# EAGLE design MotorControllerV1 (EAGLE 9.3.1)
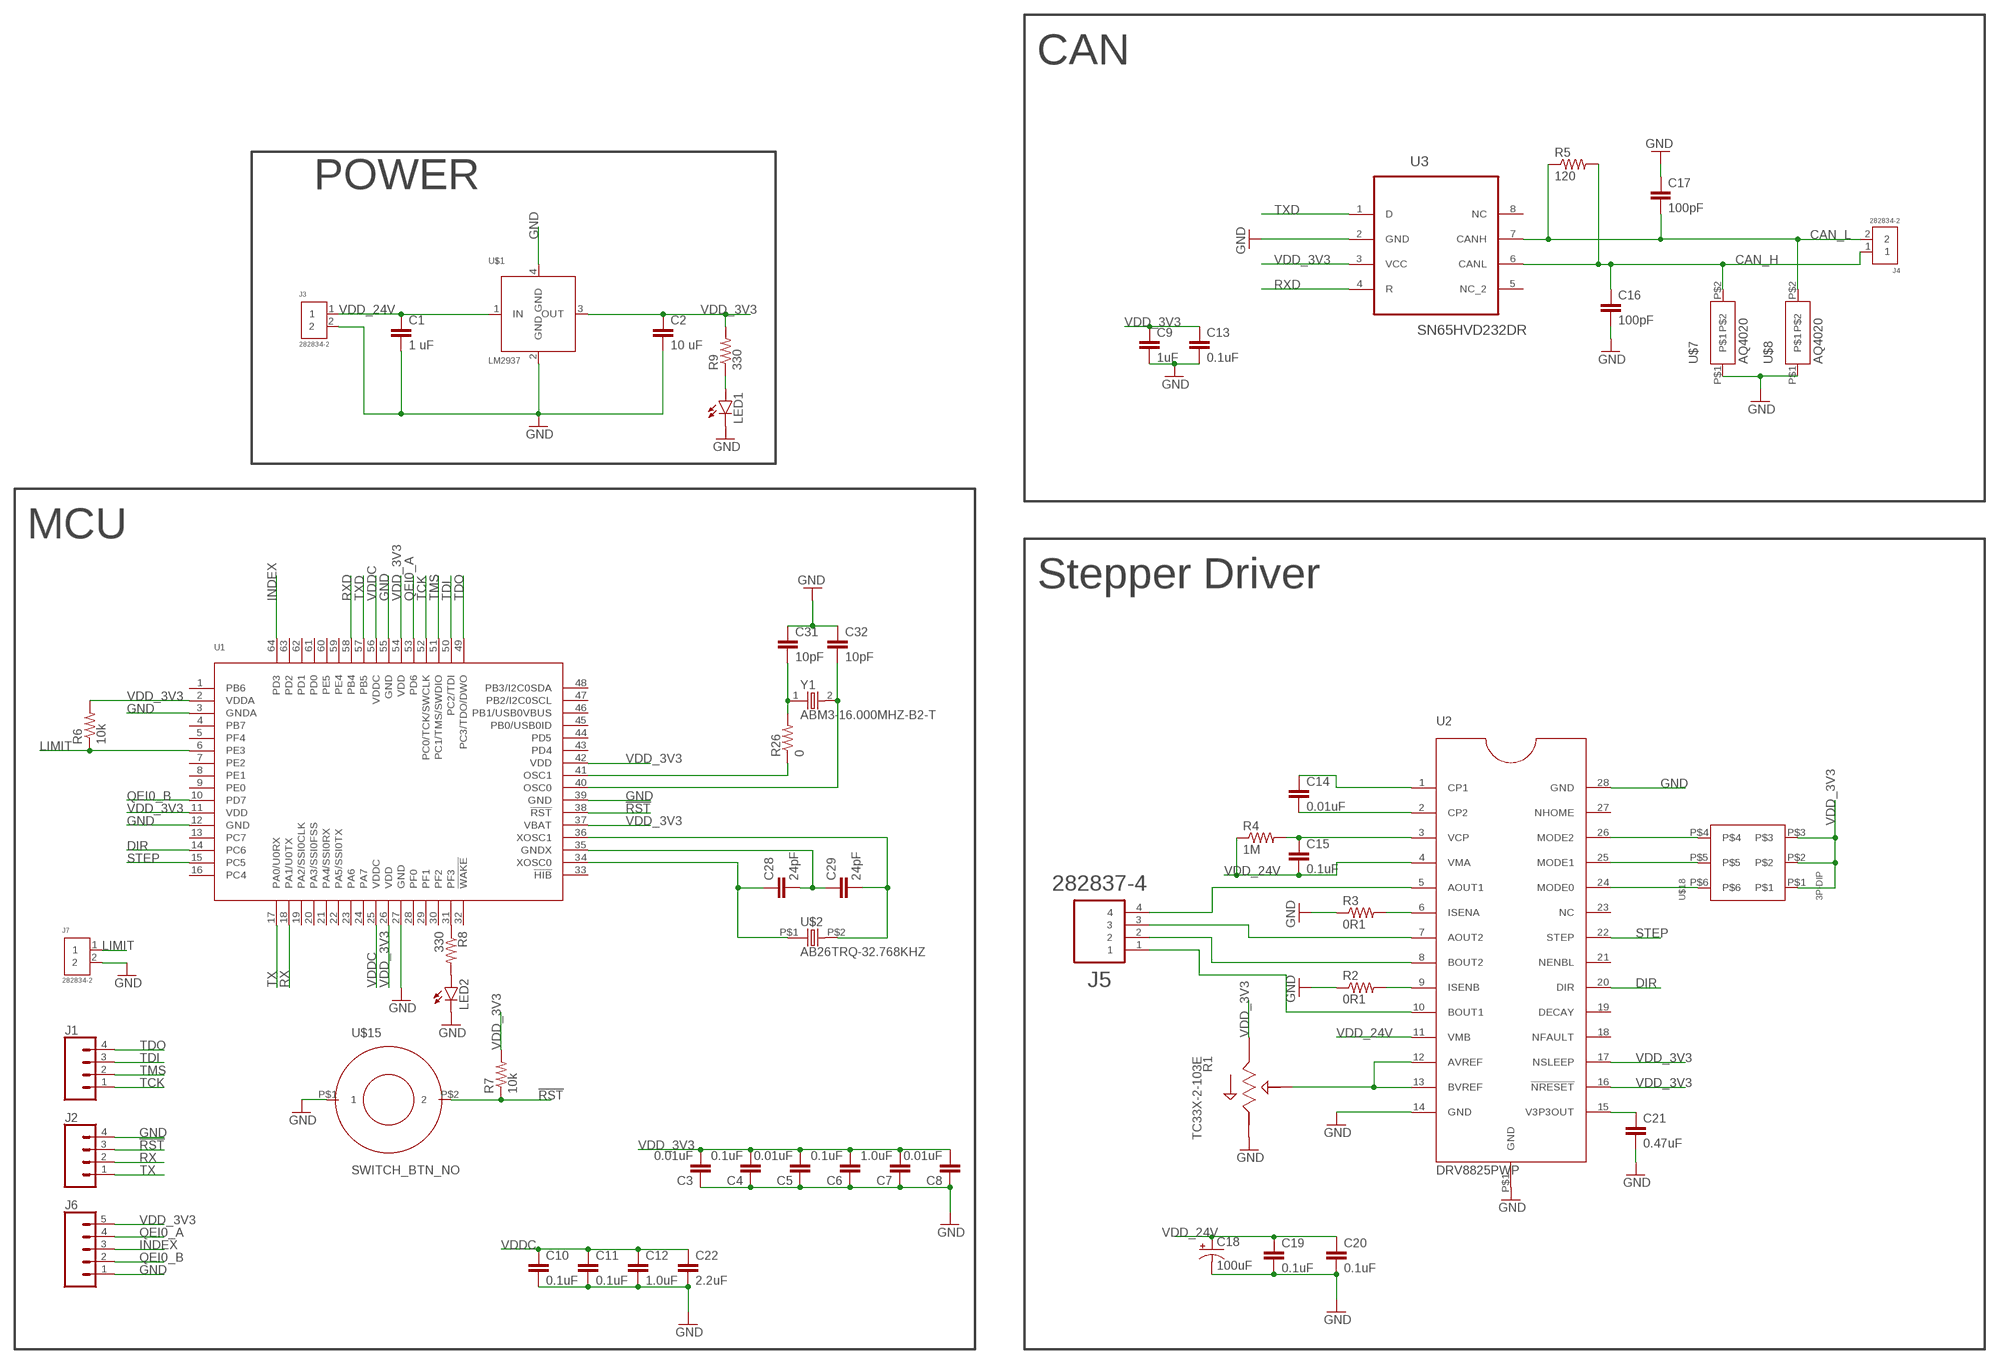
[diagram p0: schematic, sheet 1]

## Parts
C1  1 uF  CAP  [0805]
C2  10 uF  CAP  [0805]
C3  0.01uF  CAP  [0805]
C4  0.1uF  CAP  [0805]
C5  0.01uF  CAP  [0805]
C6  0.1uF  CAP  [0805]
C7  1.0uF  CAP  [0603]
C8  0.01uF  CAP  [0805]
C9  1uF  CAP  [0603]
C10  0.1uF  CAP  [0805]
C11  0.1uF  CAP  [0805]
C12  1.0uF  CAP  [0603]
C13  0.1uF  CAP  [0805]
C14  0.01uF  CAP  [0805]
C15  0.1uF  CAP  [0805]
C16  100pF  CAP  [0603]
C17  100pF  CAP  [0603]
C18  100uF  100UF-POL  [CPOL-RADIAL-3.5MM-8MM]
C19  0.1uF  CAP  [0603]
C20  0.1uF  CAP  [0603]
C21  0.47uF  CAP  [0603]
C22  2.2uF  CAP  [0805]
C28  24pF  CAP  [0805]
C29  24pF  CAP  [0805]
C31  10pF  CAP  [0805]
C32  10pF  CAP  [0805]
J1  CONN_04  [1X04]
J2  CONN_04  [1X04]
J3  282834-2  [CONN_282834-2]
J4  282834-2  [CONN_282834-2]
J5  282837-4  [TE_282837-4]
J6  CONN_05  [1X05]
J7  282834-2  [CONN_282834-2]
LED1  LED0603  [LED-0603]
LED2  LED0603  [LED-0603]
R1  TC33X-2-103E  [35WR]
R2  0R1  RES  [0805]
R3  0R1  RES  [0805]
R4  1M  RES  [0603]
R5  120  RES  [0603]
R6  10k  RES  [0603]
R7  10k  RES  [0603]
R8  330  RES  [0603]
R9  330  RES  [0603]
R26  0  RES  [0603]
U1  TM4C123GH6PMI  [QFP50P1200X1200X160-64N]
U2  DRV8825PWP  [SOP65P640X120-28N]
U3  SN65HVD232DR  [SOIC127P600X175-8N]
U$1  LM2937  [R-PDSO-G4]
U$2  AB26TRQ-32.768KHZ  [AB26TRQ]
U$7  AQ4020  [SOD323]
U$8  AQ4020  [SOD323]
U$15  SWITCH_BTN_NO  [BTN_2]
U$18  3P-DIP  [CFS-0302MB]
Y1  ABM3-16.000MHZ-B2-T  [XTAL500X320X130N]

## Nets
!RST: J2.3 R7.P$1 U1.38(!RST) U$15.P$2
CAN_H: C16.P$1 J4.1 R5.P$2 U3.6(CANL) U$7.P$2
CAN_L: C17.P$2 J4.2 R5.P$1 U3.7(CANH) U$8.P$2
DIR: U1.14(PC6) U2.20(DIR)
GND: C1.2 C2.2 C3.1 C4.1 C5.1 C6.1 C7.P$1 C8.1 C9.P$2 C10.2 C11.2 C12.P$2 C13.2 C16.P$2 C17.P$1 C18.2(-) C19.P$2 C20.P$2 C21.P$2 C22.2 C31.1 C32.1 J2.4 J3.2 J6.1 J7.2 LED1.C LED2.C R1.3 R2.1 R3.1 U1.3(GNDA) U1.12(GND) U1.27(GND) U1.39(GND) U1.55(GND) U2.14(GND) U2.28(GND) U2.P$1(GND) U3.2(GND) U$1.2(GND) U$1.4(GND) U$7.P$1 U$8.P$1 U$15.P$1
INDEX: J6.3 U1.64(PD3)
LIMIT: J7.1 R6.P$1 U1.6(PE3)
N$1: C29.2 U1.36(XOSC1) U$2.P$2
N$2: C28.1 U1.34(XOSC0) U$2.P$1
N$3: C28.2 C29.1 U1.35(GNDX)
N$4: R26.P$1 U1.41(OSC1)
N$5: LED1.A R9.P$1
N$6: C31.2 R26.P$2 Y1.1
N$7: C32.2 U1.40(OSC0) Y1.2
N$8: C14.2 U2.2(CP2)
N$9: C14.1 U2.1(CP1)
N$10: C15.1 R4.P$2 U2.3(VCP)
N$11: J5.4 U2.5(AOUT1)
N$12: R1.2 U2.12(AVREF) U2.13(BVREF)
N$13: J5.3 U2.7(AOUT2)
N$14: J5.2 U2.8(BOUT2)
N$15: J5.1 U2.10(BOUT1)
N$16: R3.2 U2.6(ISENA)
N$17: R2.2 U2.9(ISENB)
N$18: R8.P$1 U1.31(PF3)
N$19: LED2.A R8.P$2
N$20: C21.P$1 U2.15(V3P3OUT)
N$22: U2.26(MODE2) U$18.P$4
N$23: U2.25(MODE1) U$18.P$5
N$24: U2.24(MODE0) U$18.P$6
QEI0_A: J6.4 U1.53(PD6)
QEI0_B: J6.2 U1.10(PD7)
RX: J2.2 U1.18(PA1/U0TX)
RXD: U1.58(PB4) U3.4(R)
STEP: U1.15(PC5) U2.22(STEP)
TCK: J1.1 U1.52(PC0/TCK/SWCLK)
TDI: J1.3 U1.50(PC2/TDI)
TDO: J1.4 U1.49(PC3/TDO/DWO)
TMS: J1.2 U1.51(PC1/TMS/SWDIO)
TX: J2.1 U1.17(PA0/U0RX)
TXD: U1.57(PB5) U3.1(D)
VDD_3V3: C2.1 C3.2 C4.2 C5.2 C6.2 C7.P$2 C8.2 C9.P$1 C13.1 J6.5 R1.1 R6.P$2 R7.P$2 R9.P$2 U1.2(VDDA) U1.11(VDD) U1.26(VDD) U1.37(VBAT) U1.42(VDD) U1.54(VDD) U2.16(!NRESET) U2.17(NSLEEP) U3.3(VCC) U$1.3(OUT) U$18.P$1 U$18.P$2 U$18.P$3
VDD_24V: C1.1 C15.2 C18.1(+) C19.P$1 C20.P$1 J3.1 R4.P$1 U2.4(VMA) U2.11(VMB) U$1.1(IN)
VDDC: C10.1 C11.1 C12.P$1 C22.1 U1.25(VDDC) U1.56(VDDC)
Unconnected: U1.1(PB6) U1.4(PB7) U1.5(PF4) U1.7(PE2) U1.8(PE1) U1.9(PE0) U1.13(PC7) U1.16(PC4) U1.19(PA2/SSI0CLK) U1.20(PA3/SSI0FSS) U1.21(PA4/SSI0RX) U1.22(PA5/SSI0TX) U1.23(PA6) U1.24(PA7) U1.28(PF0) U1.29(PF1) U1.30(PF2) U1.32(!WAKE) U1.33(!HIB) U1.43(PD4) U1.44(PD5) U1.45(PB0/USB0ID) U1.46(PB1/USB0VBUS) U1.47(PB2/I2C0SCL) U1.48(PB3/I2C0SDA) U1.59(PE4) U1.60(PE5) U1.61(PD0) U1.62(PD1) U1.63(PD2) U2.18(NFAULT) U2.19(DECAY) U2.21(NENBL) U2.23(NC) U2.27(NHOME) U3.5(NC_2) U3.8(NC)

## Notes on the sheet
- CAN
- POWER
- MCU
- Stepper Driver

## Library data of the parts
C1-C6 C8 C10 C11 C13-C15 C22 C28 C29 C31 C32 = Ilya_Teach:CAP
C7 C9 C12 C16 C17 C19-C21 = MicahLBR:CAP
C18 = MicahLBR:100UF-POL
J1 J2 = SparkFun-Connectors:CONN_04: Multi connection point. Often used as Generic Header-pin footprint for 0.1 inch spaced/style header connections On any of the 0.1 inch spaced packages, you can populate with these: Break Away Headers - Straight <https://www.sparkfun.com/products/116> (PRT-00116) Break Away Male Headers - Right Angle <https://www.sparkfun.com/products/553> (PRT-00553) Female Headers <https://www.sparkfun.com/products/115> (PRT-00115) Break Away Headers - Machine Pin <https://www.sparkfun.com/products/117> (PRT-00117) Break Away Female Headers - Swiss Machine Pin <https://www.sparkfun.com/products/743> (PRT-00743) For SCREWTERMINALS and SPRING TERMINALS visit here: Screw Terimnals on SparkFun.com <https://www.sparkfun.com/search/results?term=Screw+Terminals> (5mm/3.5mm/2.54mm spacing) This device is also useful as a general connection point to wire up your design to another part of your project. Our various solder wires solder well into these plated through hole pads. Hook-Up Wire - Assortment (Stranded, 22 AWG) <https://www.sparkfun.com/products/11375> (PRT-11375) Hook-Up Wire - Assortment (Solid Core, 22 AWG) <https://www.sparkfun.com/products/11367> (PRT-11367) View the entire wire category on our website here <https://www.sparkfun.com/categories/141> Special notes: Molex polarized connector foot print use with SKU : PRT-08231 with associated crimp pins and housings. 1MM SMD Version SKU: PRT-10208; PROD_ID: CONN-09696
J3 J4 J7 = 282834-2:282834-2: Terminal block; 2.54mm; angled 90°; 0.03÷1mm2; ways: 2; 10A; H: 10mm; CENTERLINE_PITCH: 2.54 mm[.1 in]; COMMENT: 282834-2; DESCRIPTION: TERMI-BLOK PCB MOUNT, 90 2P.; DIGI-KEY_PART_NUMBER: A98333-ND; DIGI-KEY_PURCHASE_URL: https://www.digikey.com/product-detail/en/te-connectivity-amp-connectors/282834-2/A98333-ND/1150135?utm_source=snapeda&utm_medium=aggregator&utm_campaign=symbol; EU_ROHS_COMPLIANCE: Compliant with Exemptions; MF: TE Connectivity; MP: 282834-2; NUMBER_OF_POSITIONS: 2; PACKAGE: None; TE_PURCHASE_URL: https://www.te.com/usa-en/product-282834-2.html?te_bu=Cor&te_type=disp&te_campaign=seda_glo_cor-seda-global-disp-prtnr-fy19-seda-model-bom-cta_sma-317_1&elqCampaignId=32493
J5 = 282837-4:282837-4: TERM BLOCK 5.08MM 4POS SIDE ENTY; COMMENT: 282837-4; DESCRIPTION: TERMI-BLOK PCB MOUNT 4P; DIGI-KEY_PART_NUMBER: A124423-ND; DIGI-KEY_PURCHASE_URL: https://www.digikey.com/product-detail/en/te-connectivity-amp-connectors/282837-4/A124423-ND/2187975?utm_source=snapeda&utm_medium=aggregator&utm_campaign=symbol; EU_ROHS_COMPLIANCE: Compliant with Exemptions; MF: TE Connectivity; MP: 282837-4; PACKAGE: None; TE_PURCHASE_URL: https://www.te.com/usa-en/product-282837-4.html?te_bu=Cor&te_type=disp&te_campaign=seda_glo_cor-seda-global-disp-prtnr-fy19-seda-model-bom-cta_sma-317_1&elqCampaignId=32493
J6 = SparkFun-Connectors:CONN_05: Multi connection point. Often used as Generic Header-pin footprint for 0.1 inch spaced/style header connections On any of the 0.1 inch spaced packages, you can populate with these: Break Away Headers - Straight <https://www.sparkfun.com/products/116> (PRT-00116) Break Away Male Headers - Right Angle <https://www.sparkfun.com/products/553> (PRT-00553) Female Headers <https://www.sparkfun.com/products/115> (PRT-00115) Break Away Headers - Machine Pin <https://www.sparkfun.com/products/117> (PRT-00117) Break Away Female Headers - Swiss Machine Pin <https://www.sparkfun.com/products/743> (PRT-00743) For SCREWTERMINALS and SPRING TERMINALS visit here: Screw Terimnals on SparkFun.com <https://www.sparkfun.com/search/results?term=Screw+Terminals> (5mm/3.5mm/2.54mm spacing) This device is also useful as a general connection point to wire up your design to another part of your project. Our various solder wires solder well into these plated through hole pads. Hook-Up Wire - Assortment (Stranded, 22 AWG) <https://www.sparkfun.com/products/11375> (PRT-11375) Hook-Up Wire - Assortment (Solid Core, 22 AWG) <https://www.sparkfun.com/products/11367> (PRT-11367) View the entire wire category on our website here <https://www.sparkfun.com/categories/141> Special notes: Molex polarized connector foot print use with SKU : PRT-08231 with associated crimp pins and housings. 1MM SMD Version SKU: PRT-10208
LED1 LED2 = Ilya_Teach:LED: LEDs Standard schematic elements and footprints for 5mm, 3mm, 1206, and 0603 sized LEDs. 5mm - Spark Fun Electronics SKU : COM-00529 (and others)
R1 = TC33X-2-103E:TC33X-2-103E: http://octopart.com/tc33x-2-103e-bourns-68150; DESCRIPTION: Res Trimmer 10K Ohm 25% 0.1W_1/10W_ 1_Elec_/1_Mech_Turn _3 X 3.8mm_ Foot Print SMD Embossed T/R; DIGI-KEY_PART_NUMBER: TC33X-103ECT-ND; DIGI-KEY_PURCHASE_URL: https://www.digikey.com/product-detail/en/bourns-inc/TC33X-2-103E/TC33X-103ECT-ND/612911?utm_source=snapeda&utm_medium=aggregator&utm_campaign=symbol; MF: Bourns; MP: TC33X-2-103E; PACKAGE: FakePackage u
R2 R3 = Ilya_Teach:RES
R4-R9 R26 = MicahLBR:RES
U1 = TM4C123GH6PMI:TM4C123GH6PMI: MCU 32-Bit Tiva C ARM Cortex M4F RISC 256KB Flash 1.2V/3.3V 64-Pin LQFP Tray/Tube; AVAILABILITY: Unavailable; DESCRIPTION: MCU 32-Bit Tiva C ARM Cortex M4F RISC 256KB Flash 1.2V/3.3V 64-Pin LQFP Tray/Tube; MF: Texas Instruments; MP: TM4C123GH6PMI; PACKAGE: LQFP-64 Texas Instruments; PRICE: None
U2 = DRV8825PWP:DRV8825PWP: DRV8825 Stepper Motor Controller IC; AVAILABILITY: Unavailable; DESCRIPTION: 2.5A Bipolar Stepper Motor Driver with On-Chip 1/32 Microstepping Indexer _Step/Dir Ctrl_ 28-HTSSOP -40 to 85; MF: Texas Instruments; MP: DRV8825PWP; PACKAGE: HTSSOP-28 Texas Instruments; PRICE: None
U3 = SN65HVD232DR:SN65HVD232DR: 3.3-V CAN TRANSCEIVERS; AVAILABILITY: Unavailable; DESCRIPTION: CAN 1Mbps 3.3V Industrial 8-Pin SOIC T/R; MF: Texas Instruments; MP: SN65HVD232DR; PACKAGE: SOIC-8 Texas Instruments; PRICE: None
U$1 = MicahLBR:LM2937
U$2 = MicahLBR:AB26TRQ-32.768KHZ
U$7 U$8 = MicahLBR:AQ4020
U$15 = Ilya_Teach:SWITCH_BTN_NO
U$18 = MicahLBR:3P-DIP
Y1 = ABM3-16.000MHZ-B2-T:ABM3-16.000MHZ-B2-T: Crystals 12MHz 18pF 30ppm -40C +85C; AVAILABILITY: Unavailable; DESCRIPTION: Crystal 16MHz Ø·Â¢Ø¢Â±20ppm _Tol_ Ø·Â¢Ø¢Â±50ppm _Stability_ 18pF FUND 50Ohm 2-Pin CSMD T/R; MF: Abracon; MP: ABM3-16.000MHZ-B2-T; PACKAGE: SMD-2 Abracon; PRICE: None

## Board
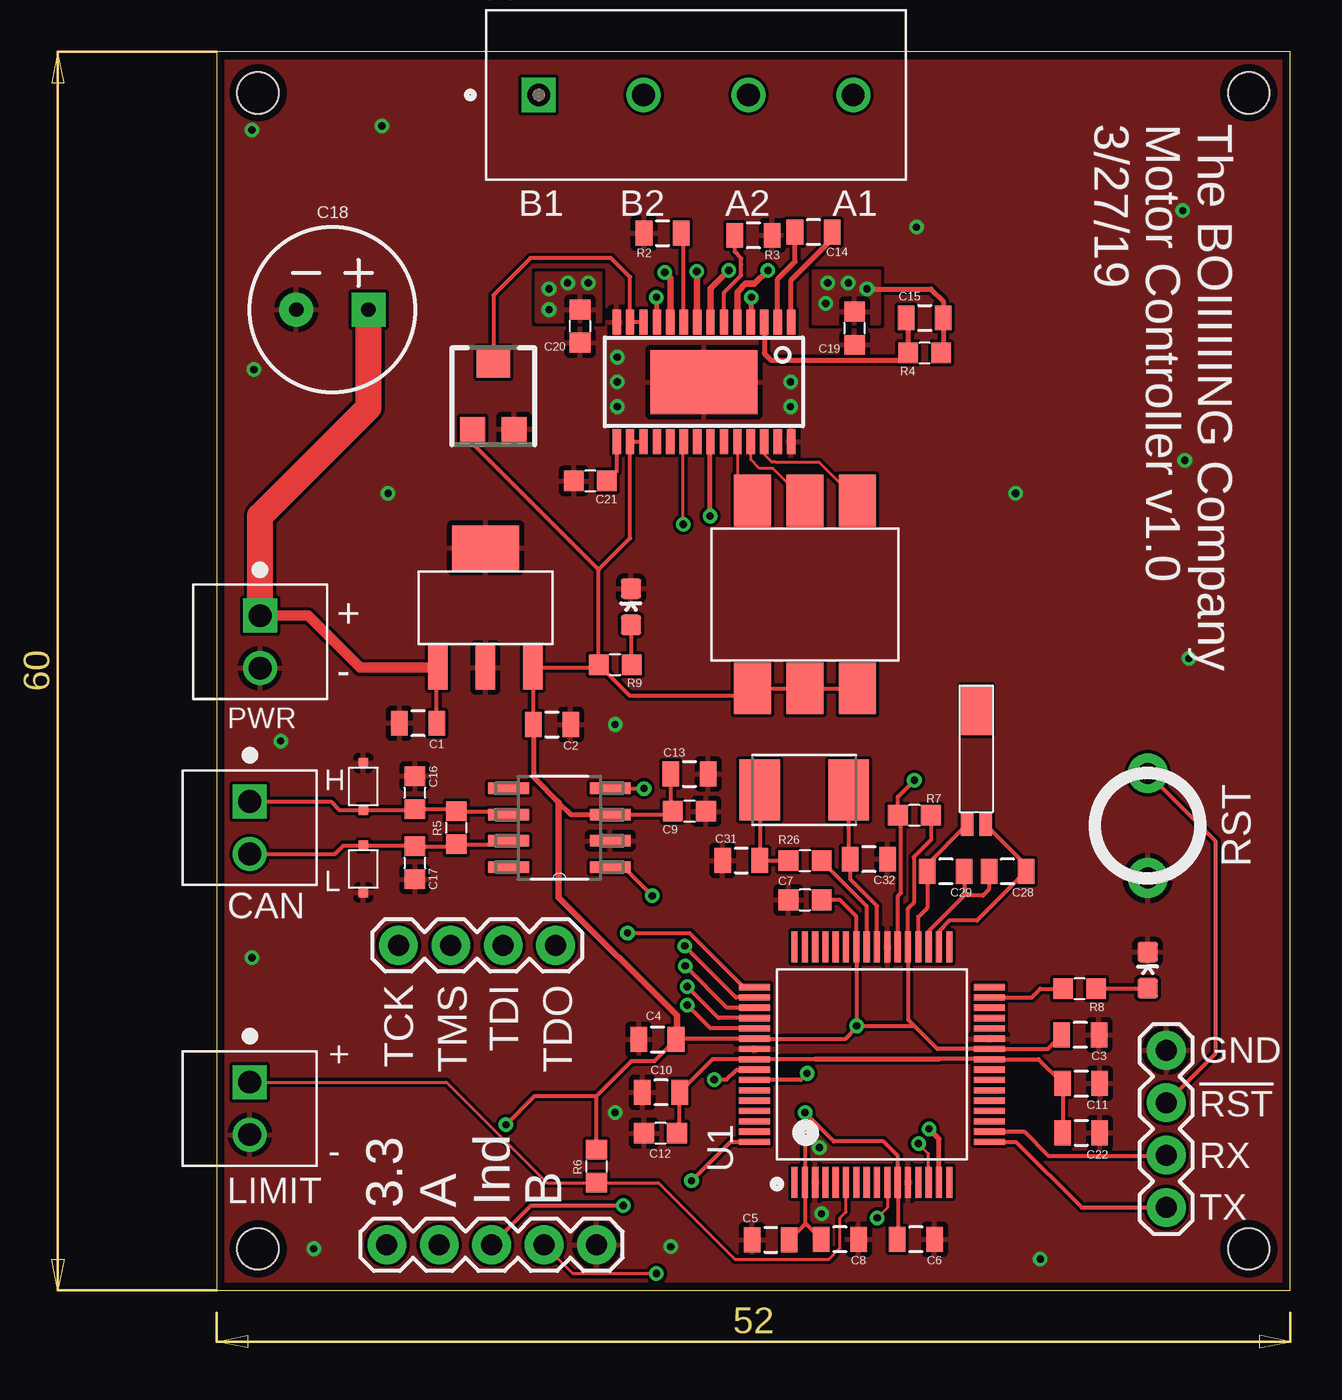
[diagram p1: board, top side]
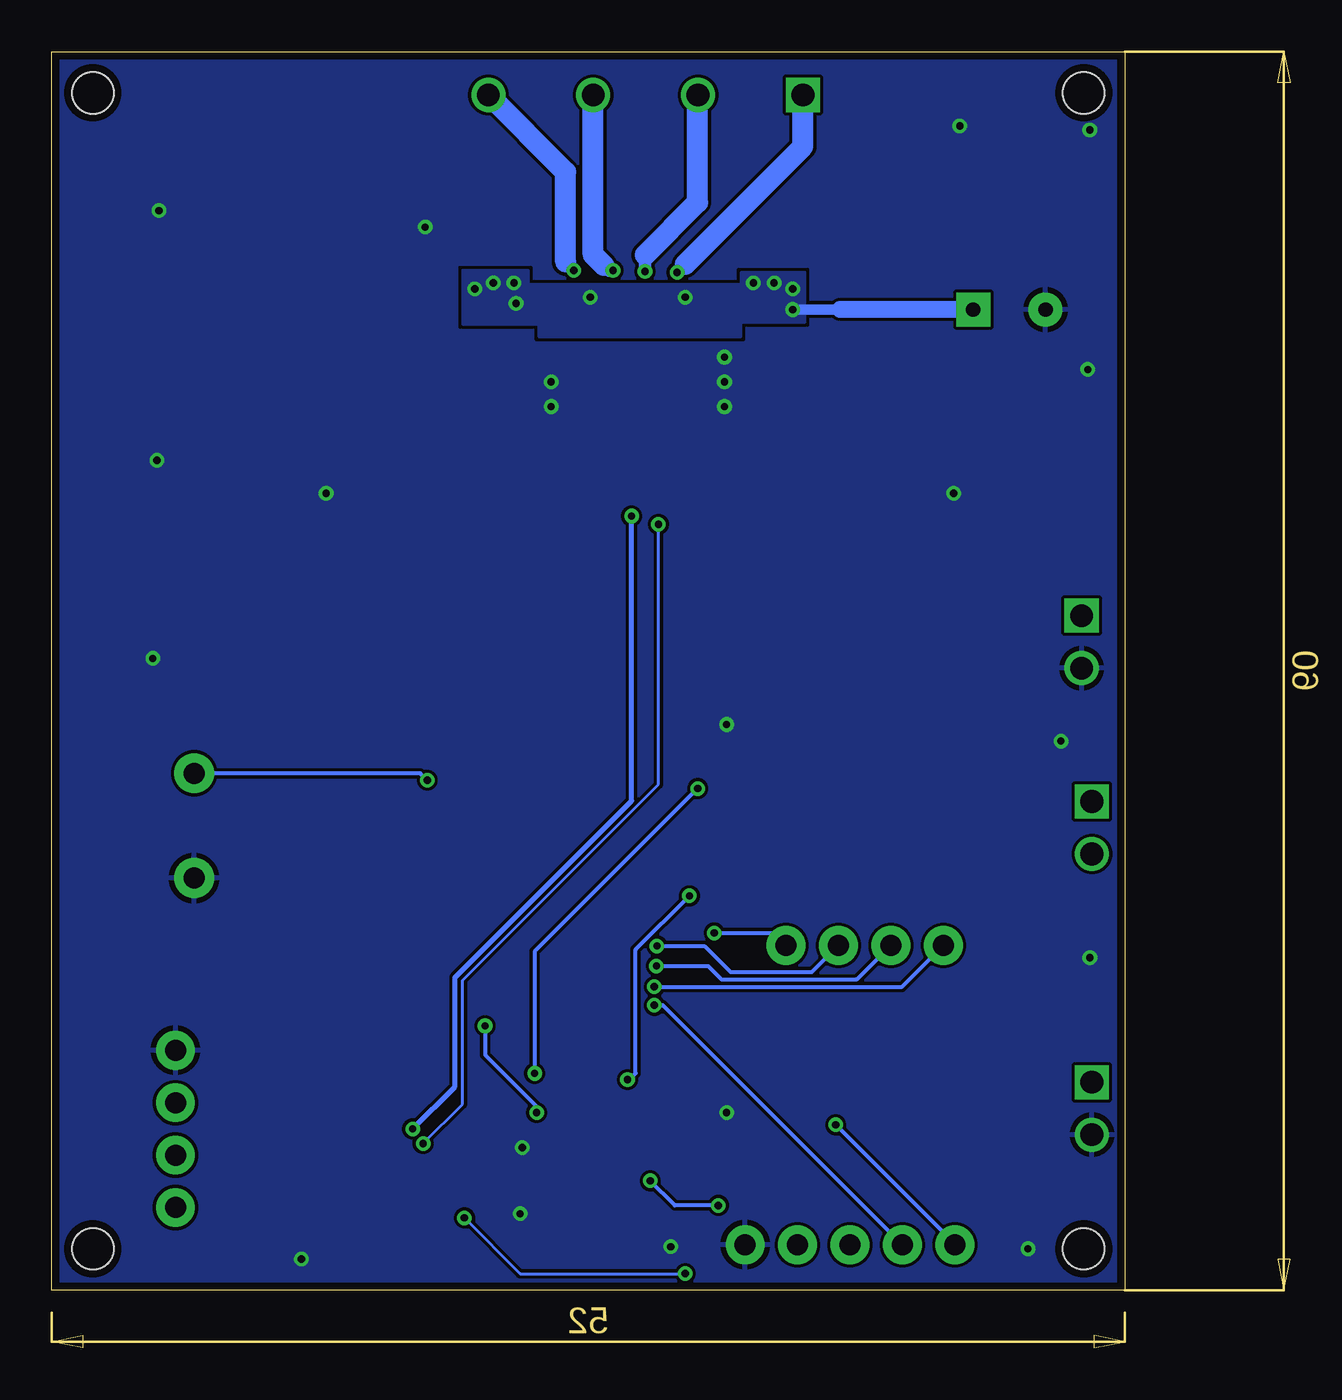
[diagram p2: board, bottom side, seen from below]

Size 52 x 60 mm. Coordinates in mm from the lower left corner, seen from the top.
Outline: 0,0 52,0 52,60 0,60 0,0
Copper layers (1*16): Top 0.0356mm / dielectric 1.5011mm / Bottom 0.0356mm
Design rules "LaenPCBOrder": minimum track width 6mil, minimum drill 13mil, track to track 6mil, track to pad 6mil, pad to pad 6mil, via to via 6mil, smd to smd 6mil, copper to edge 15mil, drill to drill 6mil, minimum pad ring 7mil, minimum via ring 7mil, stop-mask expansion 3mil, vias tented up to drill 0mil, thermal gap 10mil
Holes 2 mm at 2,2 50,2 2,58 50,58

### Footprints (pad centres in the part's own frame; a part is rotated, then mirrored left to right if it is on the bottom)
0805 = smd 0.8 x 1.2: 1 -0.9,0; 2 0.9,0
0603 = smd 0.95 x 1: P$1 -0.8,0; P$2 0.8,0
CPOL-RADIAL-3.5MM-8MM = drill 0.7 pad 1.651 square: 1 1.75,0 | drill 0.7 pad 1.651: 2 -1.75,0
1X04 = drill 1.016 pad 1.88: 1 0,0; 2 2.54,0; 3 5.08,0; 4 7.62,0
CONN_282834-2 = drill 1.1 square: 1 -1.27,0 | drill 1.1: 2 1.27,0
TE_282837-4 = drill 1.1 square: 1 0,0 | drill 1.1: 2 5.08,0; 3 10.16,0; 4 15.24,0
1X05 = drill 1.016 pad 1.88: 1 0,0; 2 2.54,0; 3 5.08,0; 4 7.62,0; 5 10.16,0
LED-0603 = smd 1 x 1: A 0,-0.877; C 0,0.877
35WR = smd 1.2 x 1.2: 1 -1,-1.6; 3 1,-1.6 | smd 1.6 x 1.5: 2 0,1.65
QFP50P1200X1200X160-64N = smd 1.5 x 0.3: 1 -5.7,3.75; 2 -5.7,3.25; 3 -5.7,2.75; 4 -5.7,2.25; 5 -5.7,1.75; 6 -5.7,1.25; 7 -5.7,0.75; 8 -5.7,0.25; 9 -5.7,-0.25; 10 -5.7,-0.75; 11 -5.7,-1.25; 12 -5.7,-1.75; 13 -5.7,-2.25; 14 -5.7,-2.75; 15 -5.7,-3.25; 16 -5.7,-3.75; 33 5.7,-3.75; 34 5.7,-3.25; 35 5.7,-2.75; 36 5.7,-2.25; 37 5.7,-1.75; 38 5.7,-1.25; 39 5.7,-0.75; 40 5.7,-0.25; 41 5.7,0.25; 42 5.7,0.75; 43 5.7,1.25; 44 5.7,1.75; 45 5.7,2.25; 46 5.7,2.75; 47 5.7,3.25; 48 5.7,3.75 | smd 0.3 x 1.5: 17 -3.75,-5.7; 18 -3.25,-5.7; 19 -2.75,-5.7; 20 -2.25,-5.7; 21 -1.75,-5.7; 22 -1.25,-5.7; 23 -0.75,-5.7; 24 -0.25,-5.7; 25 0.25,-5.7; 26 0.75,-5.7; 27 1.25,-5.7; 28 1.75,-5.7; 29 2.25,-5.7; 30 2.75,-5.7; 31 3.25,-5.7; 32 3.75,-5.7; 49 3.75,5.7; 50 3.25,5.7; 51 2.75,5.7; 52 2.25,5.7; 53 1.75,5.7; 54 1.25,5.7; 55 0.75,5.7; 56 0.25,5.7; 57 -0.25,5.7; 58 -0.75,5.7; 59 -1.25,5.7; 60 -1.75,5.7; 61 -2.25,5.7; 62 -2.75,5.7; 63 -3.25,5.7; 64 -3.75,5.7
SOP65P640X120-28N = smd 1.2 x 0.4: 1 -2.9,4.225; 2 -2.9,3.575; 3 -2.9,2.925; 4 -2.9,2.275; 5 -2.9,1.625; 6 -2.9,0.975; 7 -2.9,0.325; 8 -2.9,-0.325; 9 -2.9,-0.975; 10 -2.9,-1.625; 11 -2.9,-2.275; 12 -2.9,-2.925; 13 -2.9,-3.575; 14 -2.9,-4.225; 15 2.9,-4.225; 16 2.9,-3.575; 17 2.9,-2.925; 18 2.9,-2.275; 19 2.9,-1.625; 20 2.9,-0.975; 21 2.9,-0.325; 22 2.9,0.325; 23 2.9,0.975; 24 2.9,1.625; 25 2.9,2.275; 26 2.9,2.925; 27 2.9,3.575; 28 2.9,4.225 | smd 3.1 x 5.18: P$1 0,0
SOIC127P600X175-8N = smd 1.981 x 0.559: 1 -2.464,1.905; 2 -2.464,0.635; 3 -2.464,-0.635; 4 -2.464,-1.905; 5 2.464,-1.905; 6 2.464,-0.635; 7 2.464,0.635; 8 2.464,1.905
R-PDSO-G4 = smd 0.95 x 2.15: 1 -2.3,-2.9; 2 0,-2.9; 3 2.3,-2.9 | smd 3.25 x 2.15: 4 0,2.9
AB26TRQ = smd 1.1 x 0.6: P$1 2.45,0.45; P$2 2.45,-0.45 | smd 2.4 x 1.5: P$3 -3.1,0
SOD323 = smd 0.49 x 0.45: P$1 1.14,0; P$2 -1.14,0
BTN_2 = drill 1.016 pad 1.93: P$1 -2.54,0; P$2 2.54,0
CFS-0302MB = smd 1.8 x 2.5: P$1 -2.54,-4.55; P$2 0,-4.55; P$3 2.54,-4.55; P$4 2.54,4.55; P$5 0,4.55; P$6 -2.54,4.55
XTAL500X320X130N = smd 1.95 x 2.95: 1 -2.15,0; 2 2.15,0

### Placement (x,y rotation side)
C1  9.76,27.47 180 top
C2  16.24,27.41 0 top
C3  41.84,12.36 180 top
C4  21.35,12.14 0 top
C5  26.84,2.44 0 top
C6  33.87,2.46 180 top
C7  28.5,18.9 0 top
C8  30.19,2.46 180 top
C9  22.9,23.2 0 top
C10  21.52,9.58 180 top
C11  41.88,10.01 0 top
C12  21.5,7.6 180 top
C13  22.9,25 0 top
C14  28.91,51.25 180 top
C15  34.3,47.1 0 top
C16  9.6,24.1 90 top
C17  9.6,20.7 90 top
C18  5.6,47.5 0 top
C19  30.9,46.6 270 top
C20  17.6,46.7 270 top
C21  18.1,39.2 180 top
C22  41.88,7.62 0 top
C28  38.31,20.28 180 top
C29  35.32,20.28 180 top
C31  25.41,20.82 0 top
C32  31.6,20.88 180 top
J1  8.8,16.7 0 top
J2  46,4 90 top
J3  2.1,31.4 270 top
J4  1.6,22.4 270 top
J5  15.6,57.9 0 top
J6  18.4,2.2 180 top
J7  1.6,8.8 270 top
LED1  20.07,33.1 0 top
LED2  45.1,15.5 0 top
R1  13.4,43.3 0 top
R2  21.6,51.2 0 top
R3  26,51.1 180 top
R4  34.3,45.4 180 top
R5  11.6,22.4 90 top
R6  18.4,6 90 top
R7  33.8,23 0 top
R8  41.8,14.6 0 top
R9  19.3,30.3 180 top
R26  28.5,20.8 180 top
U1  31.74,10.93 90 top
U2  23.6,44 270 top
U3  16.6,22.4 180 top
U$1  13.02,33.06 0 top
U$2  36.8,25 270 top
U$7  7.1,24.4 90 top
U$8  7.1,20.4 270 top
U$15  45.1,22.5 90 top
U$18  28.5,33.7 0 top
Y1  28.46,24.23 0 top

### Tracks (layer width: path | path; a pad name or v marks a point on that pad's centre or on a via)
!RST  (via drill 0.35)
  Top 0.2: U1.38 32.99,19.09 33.15,19.25 33.15,22.85 R7.P$1 33,23.9 v33.8,24.7 | J2.3 48.4,11.48 48.4,21.74 U$15.P$2
  Bottom 0.2: v33.8,24.7 34.14,25.04 U$15.P$2
CAN_H
  Top 0.2: J4.1 5.53,23.67 5.94,23.26 U$7.P$2 9.56,23.26 C16.P$1 11.5,23.3 R5.P$2 13.97,23.2 U3.6
CAN_L
  Top 0.2: J4.2 5.73,21.13 6.14,21.54 U$8.P$2 9.56,21.54 C17.P$2 11.5,21.5 R5.P$1 13.97,21.6 U3.7
DIR  (via drill 0.35)
  Top 0.152: U1.14 34.49,6.61 v34,7.1 | v22.6,37.1 22.6,41.08 U2.20
  Bottom 0.152: v34,7.1 32.1,9 32.1,15 22.6,24.5 v22.6,37.1
GND  (via drill 0.35)
  other vias: 29.2,6.9 22,2.1 29.3,3.7 19.3,8.6 1.8,44.6 1.7,56.2 8,56.4 19.4,45.2 19.4,44 19.4,42.8 27.8,44 27.8,42.8 1.7,16.1 4.7,2 3.1,26.6 39.9,1.5 19.3,27.4 8.3,38.6 33.9,51.5 46.8,52.3 46.9,40.2 47.1,30.6 38.7,38.6
  pour Top (rank 2): 0,60 0,0 60,0 60,60
  pour Bottom (rank 2): 0,60 0,0 60,0 60,60
INDEX  (via drill 0.35)
  Top 0.2: J6.3 15.22,4.1 v19.7,4.1 | v23,5.3 24.88,7.18 U1.64
  Bottom 0.2: v19.7,4.1 21.8,4.1 v23,5.3
LIMIT
  Top 0.152: J7.1 11.13,10.07 16,5.2 R6.P$1 21.4,5.2 25.1,1.5 29.65,1.5 30.2,2.05 30.2,3.5 30.49,3.79 U1.6
N$1
  Top 0.2: U1.36 33.99,18.09 34.42,18.52 C29.2 34.42,20.62 U$2.P$2
N$2
  Top 0.2: U$2.P$1 39.21,20.59 C28.1 36.83,17.9 35.5,17.9 34.99,17.39 U1.34
N$3
  Top 0.2: U1.35 34.5,17.4 36.22,19.12 | C29.1 36.22,19.12 | C28.2 37.4,19.4 37.12,19.12 36.22,19.12
N$4
  Top 0.2: U1.41 31.49,18.6 29.3,20.79 R26.P$1
N$5
  Top 0.2: R9.P$1 20.1,32.19 LED1.A
N$6
  Top 0.2: R26.P$2 26.33,20.8 C31.2 Y1.1
N$7
  Top 0.2: Y1.2 30.61,20.97 C32.2 30.7,19.9 31.99,18.61 U1.40
N$8
  Top 0.254: U2.2 27.18,48.98 28.01,49.81 C14.2
N$9
  Top 0.254: U2.1 27.82,48.92 29.81,50.91 C14.1
N$10
  Top 0.254: U2.3 26.52,45.38 26.85,45.05 33.15,45.05 R4.P$2 33.5,47 C15.1
N$11  (via drill 0.35)
  Top 0.305: v26.7,49.4 26.06,48.76 25.63,48.76 25.23,48.35 25.23,48.2 U2.5
  Bottom 0.61: v26.7,49.4 27.1,49.8
  Bottom 1.016: J5.4 27.1,54.16 27.1,49.8
N$12
  Top 0.2: U2.12 U2.13 20.02,49.08 19.1,50 15.2,50 13.4,48.2 R1.2
N$13  (via drill 0.35)
  Top 0.305: U2.7 23.93,48.52 v24.8,49.4
  Bottom 0.61: v24.8,49.4 25,49.4 25.25,49.65
  Bottom 1.016: 25.25,49.65 25.76,50.16 J5.3
N$14  (via drill 0.35)
  Top 0.305: U2.8 23.27,49.33 v23.25,49.35
  Bottom 0.61: v23.25,49.35 23.25,50.15
  Bottom 1.016: 23.25,50.15 20.7,52.7 20.7,57.88 J5.2
N$15  (via drill 0.35)
  Top 0.305: U2.10 21.98,49.02 v21.7,49.3
  Bottom 0.61: v21.7,49.3 21.3,49.7
  Bottom 1.016: J5.1 15.6,55.4 21.3,49.7
N$16
  Top 0.2: 25.41,49.69 25.41,49.99 25.1,50.3 R3.2
  Top 0.203: U2.6 24.57,48.32 25.41,49.15 25.41,49.69
N$17
  Top 0.203: U2.9 22.62,51.08 R2.2
N$18
  Top 0.2: U1.31 39.48,14.18 39.9,14.6 R8.P$1
N$19
  Top 0.2: R8.P$2 42.62,14.62 LED2.A
N$20
  Top 0.2: U2.15 19.38,39.67 C21.P$1
N$22
  Top 0.152: U$18.P$4 29.19,40.1 27.08,40.1 26.9,40.1 26.52,40.48 U2.26
N$23
  Top 0.152: U$18.P$5 26.95,39.8 26.3,39.8 25.88,40.23 25.88,40.9
  Top 0.2: 25.88,40.9 U2.25
N$24
  Top 0.152: U2.24 25.23,38.98 U$18.P$6
QEI0_A  (via drill 0.35)
  Top 0.2: U1.53 23.92,12.68 v22.8,13.8
  Bottom 0.2: v22.8,13.8 22.38,13.8 J6.4
QEI0_B  (via drill 0.35)
  Top 0.152: U1.10 32.49,3.99 v32,3.5 | v21.3,0.8 17.26,0.8 J6.2
  Bottom 0.152: v32,3.5 29.3,0.8 v21.3,0.8
RX
  Top 0.2: U1.18 39.12,7.68 40.3,6.5 45.96,6.5 J2.2
RXD  (via drill 0.35)
  Top 0.2: U3.4 v20.7,24.3 | v28.6,10.5 28.28,10.18 U1.58
  Bottom 0.2: v20.7,24.3 28.6,16.4 v28.6,10.5
STEP  (via drill 0.35)
  Top 0.254: U1.15 34.99,7.32 v34.51,7.81 | v23.9,37.5 23.9,41.08 U2.22
  Bottom 0.254: v34.51,7.81 32.46,9.86 32.46,15.15 23.9,23.7 v23.9,37.5
TCK  (via drill 0.35)
  Top 0.2: U1.52 24.32,13.18 v22.8,14.7
  Bottom 0.2: v22.8,14.7 10.8,14.7 J1.1
TDI  (via drill 0.35)
  Top 0.2: U1.50 25.16,14.18 v22.67,16.67
  Bottom 0.2: v22.67,16.67 20.37,16.67 19.11,15.4 15.18,15.4 J1.3
TDO  (via drill 0.35)
  Top 0.2: U1.49 25.52,14.68 22.92,17.28 19.92,17.28 v19.9,17.3
  Bottom 0.2: v19.9,17.3 17.02,17.3 J1.4
TMS  (via drill 0.35)
  Top 0.2: U1.51 24.72,13.68 v22.7,15.7
  Bottom 0.2: v22.7,15.7 20.2,15.7 19.55,15.05 12.99,15.05 J1.2
TX
  Top 0.2: U1.17 38.72,7.18 41.9,4 J2.1
TXD  (via drill 0.35)
  Top 0.2: v24.1,10.2 24.7,10.2 25.18,10.68 U1.57 | v21.1,19.1 19.7,20.5 U3.1
  Bottom 0.2: v24.1,10.2 24,10.2 23.7,10.5 23.7,16.5 v21.1,19.1
VDD_3V3  (via drill 0.35)
  Top 0.2: C2.1 15.32,27.43 U$1.3 18.36,30.16 R9.P$2 | 28.49,3.19 U1.2 v28.49,8.59 v28.5,8.6 29.9,7.2 32.3,7.2 32.99,6.51 U1.11 32.99,2.48 C6.2 | 28.49,3.19 C5.2 | C8.2 28.56,3.19 28.49,3.19 | C3.2 40.26,11.68 U1.26 34.92,11.68 33.8,12.8 | C7.P$2 30.2,18.9 30.99,18.11 U1.42 v30.99,12.81 v31,12.8 | R6.P$2 18.4,9.4 | 18.4,9.4 20.1,11.1 21.21,11.1 C4.2 22.29,12.18 U1.54 30.46,12.18 31,12.72 v31,12.8 | v31,12.8 33.8,12.8 | 33.8,12.8 33.49,13.11 U1.37 33.49,18.49 33.77,18.77 33.77,20.98 34.6,21.82 R7.P$2 | U3.3 21.93,23.04 C9.P$1 22,23.3 C13.1 | U$18.P$1 26,29.15 | 26,29.15 U$18.P$2 U$18.P$3 | R9.P$2 20,28.8 26,28.8 26,29.15 | v14.01,8.01 15.4,9.4 18.4,9.4 | R9.P$2 18.5,34.9 | 18.5,34.9 20.02,36.42 U2.16 U2.17 | R1.1 12.4,41 18.5,34.9
  Top 0.254: C2.1 15.34,24.86 16.57,23.64 17.16,23.04 U3.3
  Top 0.305: 16.57,23.64 16.57,19.04 22.29,13.31 22.29,12.18
  Bottom 0.2: v28.5,8.6 28.5,8.9 31,11.4 v31,12.8 | J6.5 8.24,2.24 v14.01,8.01
VDD_24V  (via drill 0.35)
  Top 0.2: C1.1 10.66,30.1 U$1.1
  Top 0.254: U2.11 21.32,48.1 v21.3,48.1 | U2.4 25.9,46.9 v25.9,48.1 | v31.5,48.5 34.6,48.5 35.2,47.9 C15.2 35.2,45.5 R4.P$1
  Top 0.508: J3.1 4.43,32.67 6.94,30.16 U$1.1
  Top 1.27: J3.1 2.1,37.5 7.35,42.75 C18.1
  Bottom 0.508: 13.8,47.5 v16.1,47.5
  Bottom 0.813: C18.1 13.8,47.5
  other vias: 16.1,48.5 17,48.8 18,48.8 29.5,47.8 29.6,48.8 30.6,48.8
  pour Top: 18.6,46.9 15.5,46.9 15.5,49.3 18.6,49.3
  pour Bottom: 21.9,46.2 18.6,46.2 18.6,46.9 15.5,46.9 15.5,49.3 18.6,49.3 18.6,48.7 28.9,48.7 28.9,49.4 31.7,49.4 32.1,49.4 32.1,46.8 28.4,46.8 28.4,46.2
  pour Top: 28.9,49.4 32.1,49.4 32.1,46.8 28.9,46.8
VDDC
  Top 0.2: 35,11.2 37.44,11.2 U1.25 39.81,11.18 C11.1 C22.1 | 29,11.2 26.04,11.2 U1.56 24.02,11.18 C10.1 22.42,7.72 C12.P$1
  Top 0.254: 29,11.2 35,11.2

### Text on the board
tPlace: The BOIIIIIING Company / Motor Controller v1.0 / 3/27/19 | B1 | B2 | A2 | A1 | + | - | PWR | H | RST | L | CAN | TCK | TMS | TDI | TDO | + | GND | !RST | - | RX | LIMIT | 3.3 | A | Ind | B | TX